# EAGLE design LED CUBE (EAGLE 9.6.2)
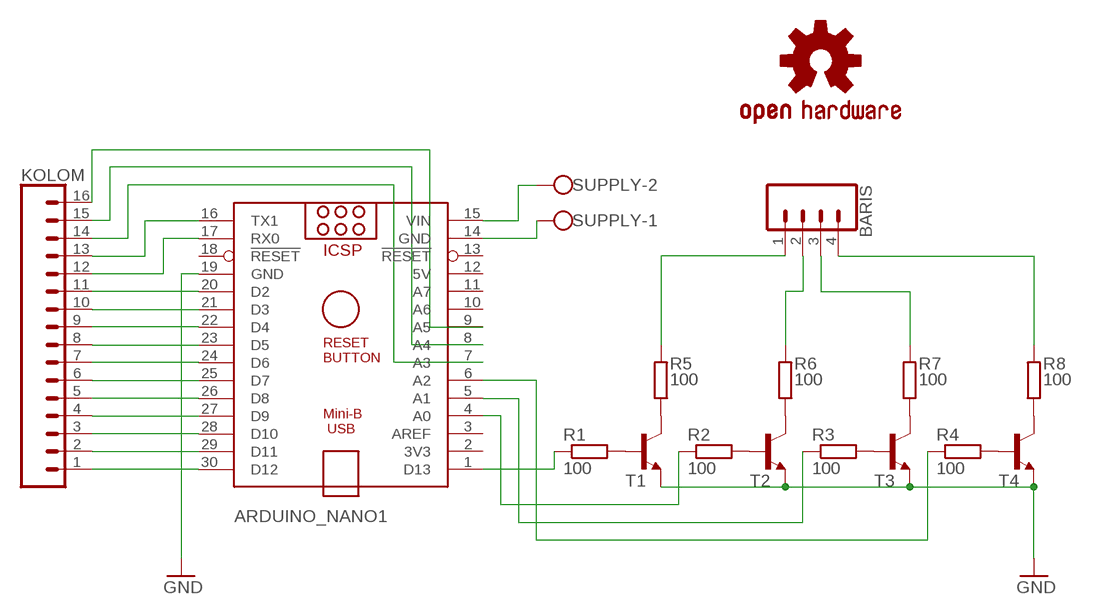
[diagram p0: schematic, sheet 1]

## Parts
ARDUINO_NANO1  ARDUINO_NANO  [ARDUINO_NANO]
BARIS  CONN_04LONGPADS  [1X04_LONGPADS]
KOLOM  CONN_16LONGPADS  [1X16_LONGPADS]
LOGO2  OSHW-LOGOL-COPPER  [OSHW-LOGO-L_COPPER]
R1  100  R-EU_0411/15  [0411/15]
R2  100  R-EU_0411/15  [0411/15]
R3  100  R-EU_0411/15  [0411/15]
R4  100  R-EU_0411/15  [0411/15]
R5  100  R-EU_0309/10  [0309/10]
R6  100  R-EU_0309/10  [0309/10]
R7  100  R-EU_0309/10  [0309/10]
R8  100  R-EU_0309/10  [0309/10]
SUPPLY  W237-102  [W237-102]
T1  -NPN-TO92-EBC  [TO92-EBC]
T2  -NPN-TO92-EBC  [TO92-EBC]
T3  -NPN-TO92-EBC  [TO92-EBC]
T4  -NPN-TO92-EBC  [TO92-EBC]

## Nets
GND: ARDUINO_NANO1.19(GND) T1.E T2.E T3.E T4.E
N$1: ARDUINO_NANO1.30(D12) KOLOM.1
N$2: ARDUINO_NANO1.29(D11) KOLOM.2
N$3: ARDUINO_NANO1.28(D10) KOLOM.3
N$4: ARDUINO_NANO1.27(D9) KOLOM.4
N$5: ARDUINO_NANO1.26(D8) KOLOM.5
N$6: ARDUINO_NANO1.25(D7) KOLOM.6
N$7: ARDUINO_NANO1.24(D6) KOLOM.7
N$8: ARDUINO_NANO1.23(D5) KOLOM.8
N$9: ARDUINO_NANO1.22(D4) KOLOM.9
N$10: ARDUINO_NANO1.21(D3) KOLOM.10
N$11: ARDUINO_NANO1.20(D2) KOLOM.11
N$12: ARDUINO_NANO1.17(RX0) KOLOM.12
N$13: ARDUINO_NANO1.16(TX1) KOLOM.13
N$14: ARDUINO_NANO1.7(A3) KOLOM.14
N$15: ARDUINO_NANO1.14(GND) SUPPLY.1
N$16: ARDUINO_NANO1.8(A4) KOLOM.15
N$17: ARDUINO_NANO1.9(A5) KOLOM.16
N$18: R1.2 T1.B
N$19: R2.2 T2.B
N$20: R3.2 T3.B
N$21: R4.2 T4.B
N$22: ARDUINO_NANO1.1(D13) R1.1
N$23: ARDUINO_NANO1.4(A0) R2.1
N$24: ARDUINO_NANO1.5(A1) R3.1
N$25: ARDUINO_NANO1.6(A2) R4.1
N$26: R5.1 T1.C
N$27: R6.1 T2.C
N$28: R7.1 T3.C
N$29: R8.1 T4.C
N$30: BARIS.1 R5.2
N$31: BARIS.2 R6.2
N$32: BARIS.3 R7.2
N$33: BARIS.4 R8.2
N$34: ARDUINO_NANO1.15(VIN) SUPPLY.2
Unconnected: ARDUINO_NANO1.2(3V3) ARDUINO_NANO1.3(AREF) ARDUINO_NANO1.10(A6) ARDUINO_NANO1.11(A7) ARDUINO_NANO1.13(!RESET) ARDUINO_NANO1.18(!RESET)

## Power pins joined to a net without a drawn wire
5V: ARDUINO_NANO1.12(5V)

## Library data of the parts
ARDUINO_NANO1 = ArduinoNanoV30:ARDUINO_NANO: Arduino Nano V3.0 Overview: The Arduino Nano is a small, complete, and breadboard-friendly board based on the ATmega328 (Arduino Nano 3.x) or ATmega168 (Arduino Nano 2.x). It has more or less the same functionality of the Arduino Duemilanove, but in a different package. It lacks only a DC power jack, and works with a Mini-B USB cable instead of a standard one. The Nano was designed and is being produced by Gravitech. Specifications: Microcontroller Atmel ATmega168 or ATmega328 Operating Voltage (logic level) 5 V Input Voltage (recommended) 7-12 V Input Voltage (limits) 6-20 V Digital I/O Pins 14 (of which 6 provide PWM output) Analog Input Pins 8 DC Current per I/O Pin 40 mA Flash Memory 16 KB (ATmega168) or 32 KB (ATmega328) of which 2 KB used by bootloader SRAM 1 KB (ATmega168) or 2 KB (ATmega328) EEPROM 512 bytes (ATmega168) or 1 KB (ATmega328) Clock Speed 16 MHz Dimensions 0.73" x 1.70" Length 45 mm Width 18 mm Weigth 5 g Power: The Arduino Nano can be powered via the Mini-B USB connection, 6-20V unregulated external power supply (pin 30), or 5V regulated external power supply (pin 27). The power source is automatically selected to the highest voltage source. Memory: The ATmega168 has 16 KB of flash memory for storing code (of which 2 KB is used for the bootloader); the ATmega328 has 32 KB, (also with 2 KB used for the bootloader). The ATmega168 has 1 KB of SRAM and 512 bytes of EEPROM (which can be read and written with the EEPROM library); the ATmega328 has 2 KB of SRAM and 1 KB of EEPROM. Input and Output: Each of the 14 digital pins on the Nano can be used as an input or output, using pinMode(), digitalWrite(), and digitalRead() functions. They operate at 5 volts. Each pin can provide or receive a maximum of 40 mA and has an internal pull-up resistor (disconnected by default) of 20-50 kOhms. In addition, some pins have specialized functions. Visit Arduino - ArduinoBoardNano <https://www.arduino.cc/en/Main/ArduinoBoardNano>
BARIS = SparkFun-Connectors:CONN_04: Multi connection point. Often used as Generic Header-pin footprint for 0.1 inch spaced/style header connections On any of the 0.1 inch spaced packages, you can populate with these: Break Away Headers - Straight <https://www.sparkfun.com/products/116> (PRT-00116) Break Away Male Headers - Right Angle <https://www.sparkfun.com/products/553> (PRT-00553) Female Headers <https://www.sparkfun.com/products/115> (PRT-00115) Break Away Headers - Machine Pin <https://www.sparkfun.com/products/117> (PRT-00117) Break Away Female Headers - Swiss Machine Pin <https://www.sparkfun.com/products/743> (PRT-00743) For SCREWTERMINALS and SPRING TERMINALS visit here: Screw Terimnals on SparkFun.com <https://www.sparkfun.com/search/results?term=Screw+Terminals> (5mm/3.5mm/2.54mm spacing) This device is also useful as a general connection point to wire up your design to another part of your project. Our various solder wires solder well into these plated through hole pads. Hook-Up Wire - Assortment (Stranded, 22 AWG) <https://www.sparkfun.com/products/11375> (PRT-11375) Hook-Up Wire - Assortment (Solid Core, 22 AWG) <https://www.sparkfun.com/products/11367> (PRT-11367) View the entire wire category on our website here <https://www.sparkfun.com/categories/141> Special notes: Molex polarized connector foot print use with SKU : PRT-08231 with associated crimp pins and housings. 1MM SMD Version SKU: PRT-10208; PROD_ID: CONN-09696
KOLOM = SparkFun-Connectors:CONN_16: Multi connection point. Often used as Generic Header-pin footprint for 0.1 inch spaced/style header connections On any of the 0.1 inch spaced packages, you can populate with these: Break Away Headers - Straight <https://www.sparkfun.com/products/116> (PRT-00116) Break Away Male Headers - Right Angle <https://www.sparkfun.com/products/553> (PRT-00553) Female Headers <https://www.sparkfun.com/products/115> (PRT-00115) Break Away Headers - Machine Pin <https://www.sparkfun.com/products/117> (PRT-00117) Break Away Female Headers - Swiss Machine Pin <https://www.sparkfun.com/products/743> (PRT-00743) For SCREWTERMINALS and SPRING TERMINALS visit here: Screw Terimnals on SparkFun.com <https://www.sparkfun.com/search/results?term=Screw+Terminals> (5mm/3.5mm/2.54mm spacing) This device is also useful as a general connection point to wire up your design to another part of your project. Our various solder wires solder well into these plated through hole pads. Hook-Up Wire - Assortment (Stranded, 22 AWG) <https://www.sparkfun.com/products/11375> (PRT-11375) Hook-Up Wire - Assortment (Solid Core, 22 AWG) <https://www.sparkfun.com/products/11367> (PRT-11367) View the entire wire category on our website here <https://www.sparkfun.com/categories/141> Special notes: Molex polarized connector foot print use with SKU : PRT-08231 with associated crimp pins and housings. 1MM SMD Version SKU: PRT-10208 NOTES ON THE VARIANTS LOCK and LOCK_LONGPADS... This footprint was designed to help hold the alignment of a through-hole component (i.e. 6-pin header) while soldering it into place. You may notice that each hole has been shifted either up or down by 0.005 of an inch from it's more standard position (which is a perfectly straight line). This slight alteration caused the pins (the squares in the middle) to touch the edges of the holes. Because they are alternating, it causes a "brace" to hold the component in place. 0.005 has proven to be the perfect amount of "off-center" position when using our standard breakaway headers. Although looks a little odd when you look at the bare footprint, once you have a header in there, the alteration is very hard to notice. Also,if you push a header all the way into place, it is covered up entirely on the bottom side.
LOGO2 = SparkFun-Aesthetics:OSHW-LOGO: Open-Source Hardware (OSHW) Logo This logo indicates the piece of hardware it is found on incorporates a OSHW license and/or adheres to the definition of open source hardware found here: http://freedomdefined.org/OSHW
R1-R8 = rcl:R-EU_: RESISTOR, European symbol; SPICEPREFIX: R
SUPPLY = con-wago-500:W237-102: WAGO SCREW CLAMP; MPN: 237-102; OC_FARNELL: unknown; OC_NEWARK: 70K9898
T1-T4 = transistor:*-NPN-: NPN Transistror BF959 corrected 2008.03.06

## Board
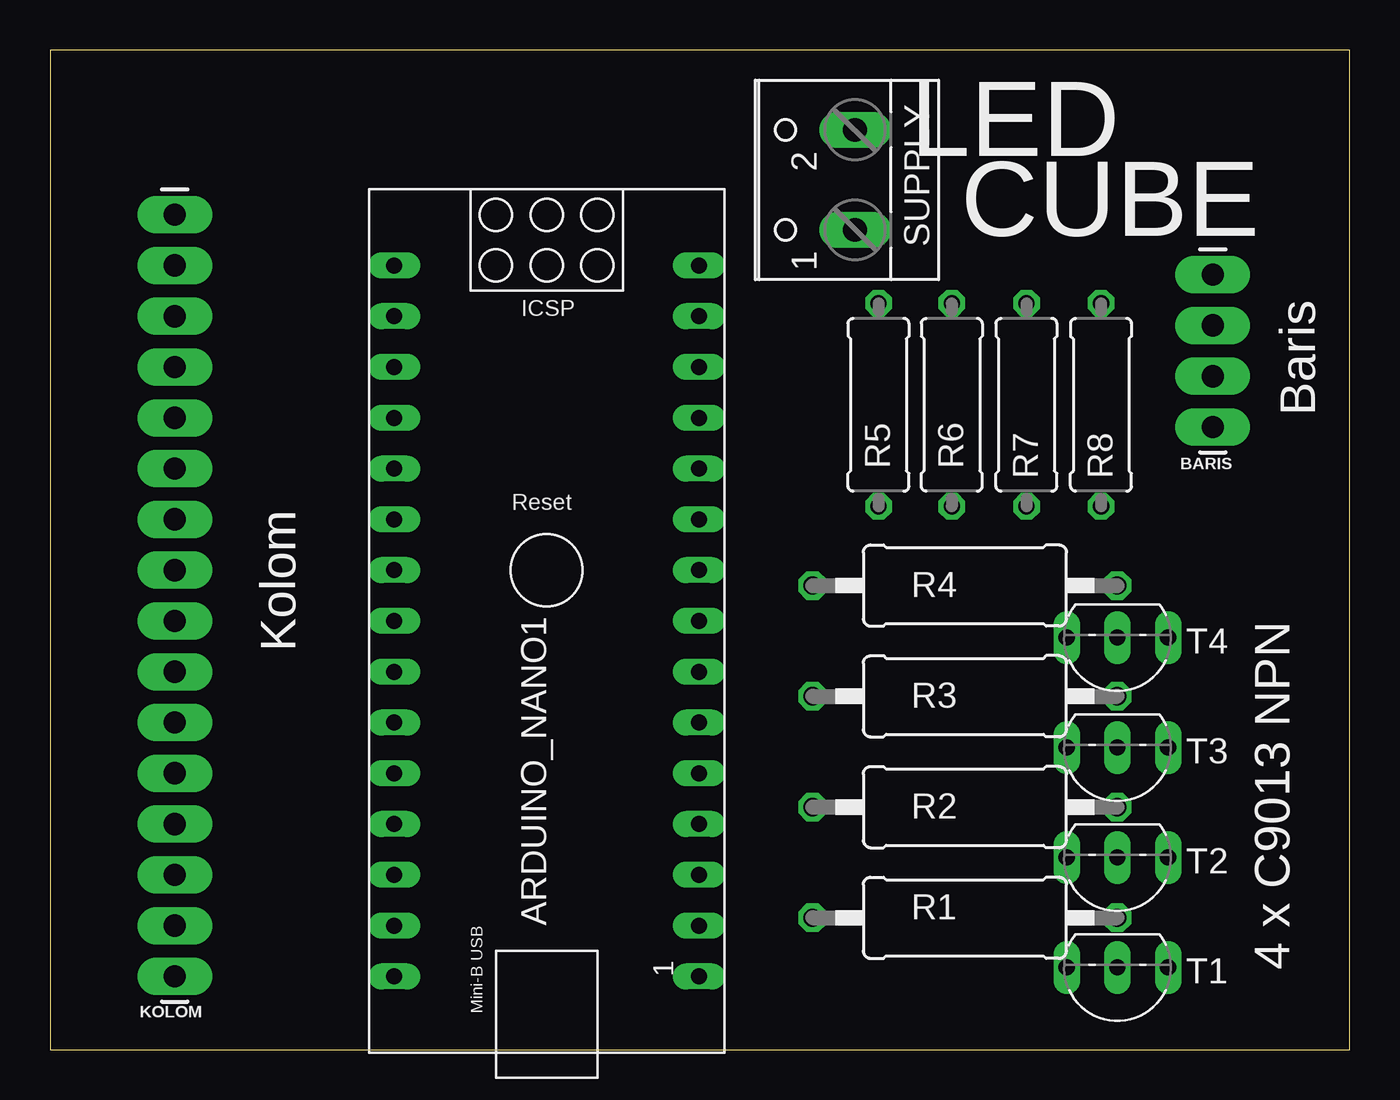
[diagram p1: board, top side]
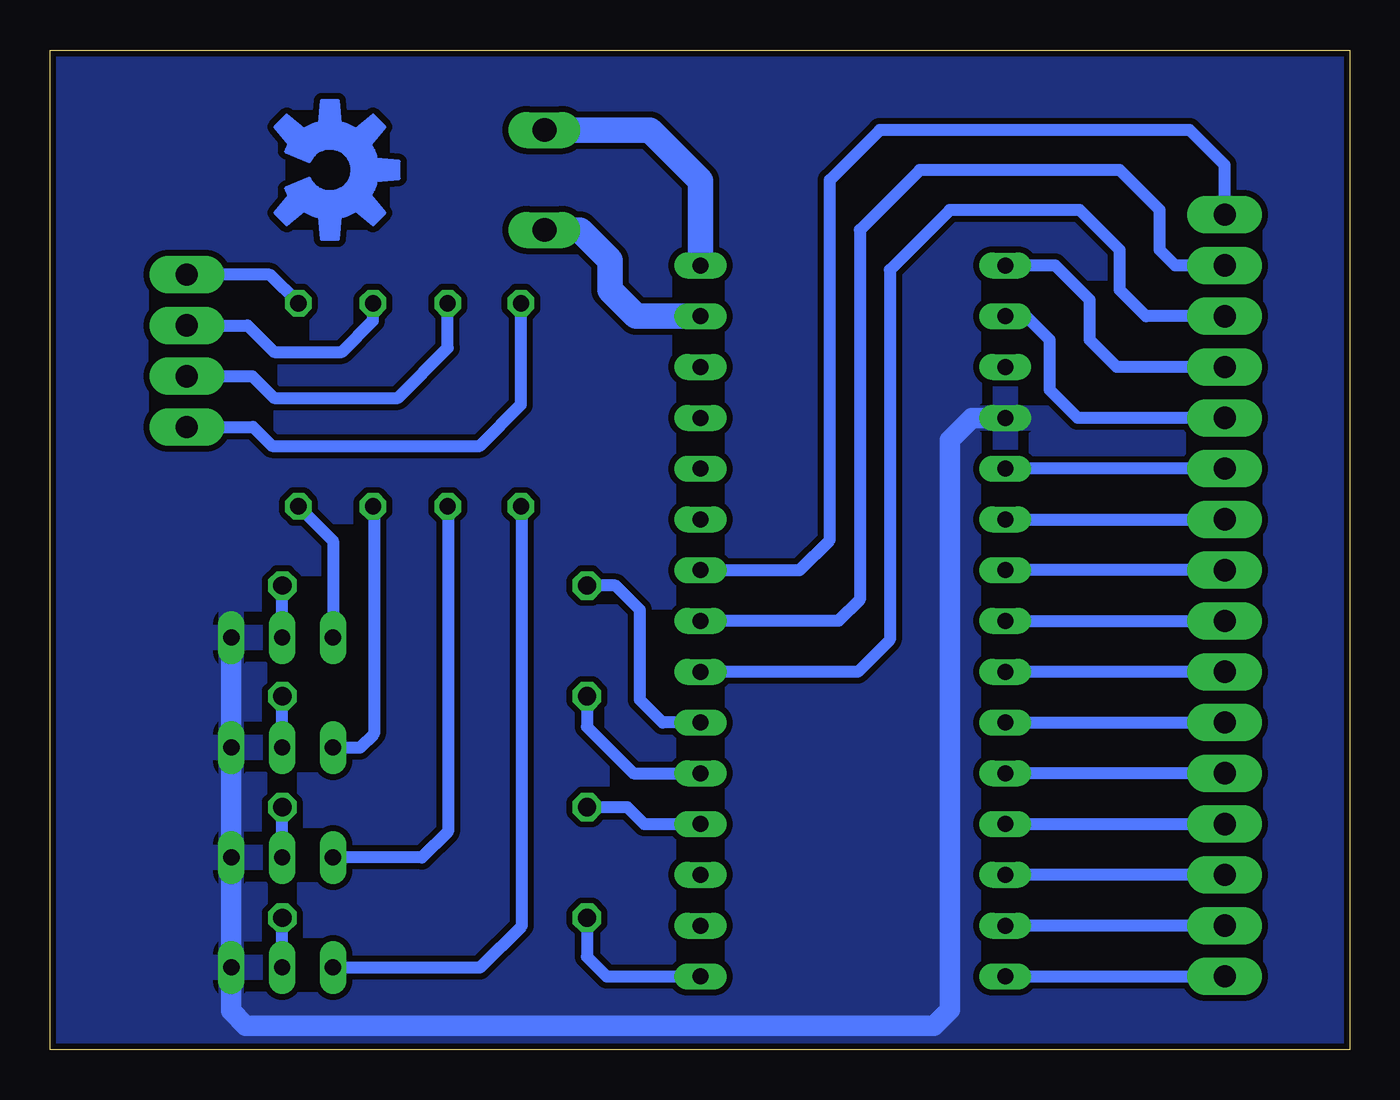
[diagram p2: board, bottom side, seen from below]

Size 65 x 50 mm. Coordinates in mm from the lower left corner, seen from the top.
Outline: 0,0 65,0 65,50 0,50 0,0
Copper layers (1*16): Top 0.035mm / dielectric 1.5mm / Bottom 0.035mm
Design rules "default *": minimum track width 6mil, minimum drill 0.35mm, track to track 0.3mm, track to pad 0.3mm, pad to pad 0.3mm, via to via 0.3mm, smd to smd 6mil, copper to edge 10mil, drill to drill 6mil, minimum pad ring 10mil, minimum via ring 8mil, stop-mask expansion 4mil, vias tented up to drill 0mil, thermal gap 10mil

### Footprints (pad centres in the part's own frame; a part is rotated, then mirrored left to right if it is on the bottom)
ARDUINO_NANO = drill 0.8 long: 1 -20.32,-7.62; 2 -17.78,-7.62; 3 -15.24,-7.62; 4 -12.7,-7.62; 5 -10.16,-7.62; 6 -7.62,-7.62; 7 -5.08,-7.62; 8 -2.54,-7.62; 9 0,-7.62; 10 2.54,-7.62; 11 5.08,-7.62; 12 7.62,-7.62; 13 10.16,-7.62; 14 12.7,-7.62; 15 15.24,-7.62; 16 15.24,7.62; 17 12.7,7.62; 18 10.16,7.62; 19 7.62,7.62; 20 5.08,7.62; 21 2.54,7.62; 22 0,7.62; 23 -2.54,7.62; 24 -5.08,7.62; 25 -7.62,7.62; 26 -10.16,7.62; 27 -12.7,7.62; 28 -15.24,7.62; 29 -17.78,7.62; 30 -20.32,7.62
1X04_LONGPADS = drill 1.118 pad 1.88 long: 1 0,0; 2 2.54,0; 3 5.08,0; 4 7.62,0
1X16_LONGPADS = drill 1.118 pad 1.88 long: 1 0,0; 2 2.54,0; 3 5.08,0; 4 7.62,0; 5 10.16,0; 6 12.7,0; 7 15.24,0; 8 17.78,0; 9 20.32,0; 10 22.86,0; 11 25.4,0; 12 27.94,0; 13 30.48,0; 14 33.02,0; 15 35.56,0; 16 38.1,0
0411/15 = drill 0.914 octagon: 1 -7.62,0; 2 7.62,0
0309/10 = drill 0.813 octagon: 1 -5.08,0; 2 5.08,0
W237-102 = drill 1.194 long: 1 -2.5,-1.27; 2 2.5,-1.27
TO92-EBC = drill 0.813 long: B 0,-1.27; C 2.54,-1.27; E -2.54,-1.27

### Placement (x,y rotation side)
ARDUINO_NANO1  24.84,23.98 90 top
BARIS  58.16,31.14 90 top
KOLOM  6.24,3.66 90 top
LOGO2  51,44 270 bottom
R1  45.76,6.59 0 top
R2  45.76,12.13 0 top
R3  45.76,17.67 0 top
R4  45.76,23.21 0 top
R5  41.44,32.25 90 top
R6  45.11,32.25 90 top
R7  48.84,32.25 90 top
R8  52.57,32.25 90 top
SUPPLY  39,43.5 90 top
T1  53.39,2.84 180 top
T2  53.39,8.34 180 top
T3  53.39,13.84 180 top
T4  53.39,19.34 180 top

### Tracks (layer width: path | path; a pad name or v marks a point on that pad's centre or on a via)
GND
  Bottom 1.016: T4.E T3.E T2.E T1.E 55.93,1.93 55.2,1.2 20.8,1.2 20,2 20,30.5 18.9,31.6 ARDUINO_NANO1.19
  pour Bottom (isolate 0.3): 0,50 65,50 65,0 0,0
N$1
  Bottom 0.61: ARDUINO_NANO1.30 KOLOM.1
N$2
  Bottom 0.61: KOLOM.2 ARDUINO_NANO1.29
N$3
  Bottom 0.61: KOLOM.3 ARDUINO_NANO1.28
N$4
  Bottom 0.61: ARDUINO_NANO1.27 KOLOM.4
N$5
  Bottom 0.61: KOLOM.5 ARDUINO_NANO1.26
N$6
  Bottom 0.61: ARDUINO_NANO1.25 KOLOM.6
N$7
  Bottom 0.61: KOLOM.7 ARDUINO_NANO1.24
N$8
  Bottom 0.61: ARDUINO_NANO1.23 KOLOM.8
N$9
  Bottom 0.61: KOLOM.9 ARDUINO_NANO1.22
N$10
  Bottom 0.61: ARDUINO_NANO1.21 KOLOM.10
N$11
  Bottom 0.61: KOLOM.11 ARDUINO_NANO1.20
N$12
  Bottom 0.61: KOLOM.12 13.6,31.6 15,33 15,35.5 16.18,36.68 ARDUINO_NANO1.17
N$13
  Bottom 0.61: KOLOM.13 11.64,34.14 13,35.5 13,37.5 14.72,39.22 ARDUINO_NANO1.16
N$14
  Bottom 0.61: KOLOM.14 10.18,36.68 11.5,38 11.5,40 13.5,42 20,42 23,39 23,20.5 24.6,18.9 ARDUINO_NANO1.7
N$15
  Bottom 1.27: SUPPLY.1 38.5,41 37,39.5 37,38 35.68,36.68 ARDUINO_NANO1.14
N$16
  Bottom 0.61: KOLOM.15 8.72,39.22 9.5,40 9.5,42 11.5,44 21.5,44 24.5,41 24.5,22.5 25.56,21.44 ARDUINO_NANO1.8
N$17
  Bottom 0.61: ARDUINO_NANO1.9 27.52,23.98 26,25.5 26,43.5 23.5,46 8,46 6.24,44.24 KOLOM.16
N$18
  Bottom 0.61: T1.B 53.39,6.1 53.38,6.11 R1.2
N$19
  Bottom 0.61: T2.B 53.39,11.64 53.38,11.65 R2.2
N$20
  Bottom 0.61: T3.B 53.39,17.18 53.38,17.19 R3.2
N$21
  Bottom 0.61: T4.B 53.39,22.72 53.38,22.73 R4.2
N$22
  Bottom 0.61: R1.1 38.14,4.64 37.16,3.66 ARDUINO_NANO1.1
N$23
  Bottom 0.61: R2.1 36.13,12.13 35.28,11.28 ARDUINO_NANO1.4
N$24
  Bottom 0.61: R3.1 38.14,16.14 35.82,13.82 ARDUINO_NANO1.5
N$25
  Bottom 0.61: ARDUINO_NANO1.6 34.36,16.36 35.5,17.5 35.5,22 36.71,23.21 R4.1
N$26
  Bottom 0.61: T1.C 43.49,4.11 41.4,6.2 41.4,27.13 R5.1
N$27
  Bottom 0.61: R6.1 45.1,10.9 46.39,9.61 T2.C
N$28
  Bottom 0.61: T3.C 49.49,15.11 48.8,15.8 48.8,27.13 R7.1
N$29
  Bottom 0.61: R8.1 50.85,25.45 T4.C
N$30
  Bottom 0.61: BARIS.1 54.84,31.14 53.9,30.2 43.5,30.2 41.44,32.26 R5.2
N$31
  Bottom 0.61: BARIS.2 54.88,33.68 53.8,32.6 47.6,32.6 45.11,35.09 R6.2
N$32
  Bottom 0.61: BARIS.3 55.12,36.22 53.8,34.9 50.4,34.9 48.84,36.46 R7.2
N$33
  Bottom 0.61: R8.2 54,38.76 BARIS.4
N$34
  Bottom 1.27: SUPPLY.2 35,46 32.46,43.46 ARDUINO_NANO1.15

### Text on the board
tPlace: LED | CUBE | Baris | Kolom | 4 x C9013 NPN